# Altium schematic sheet NandFlash.SchDoc: main_assy PCB
size A4
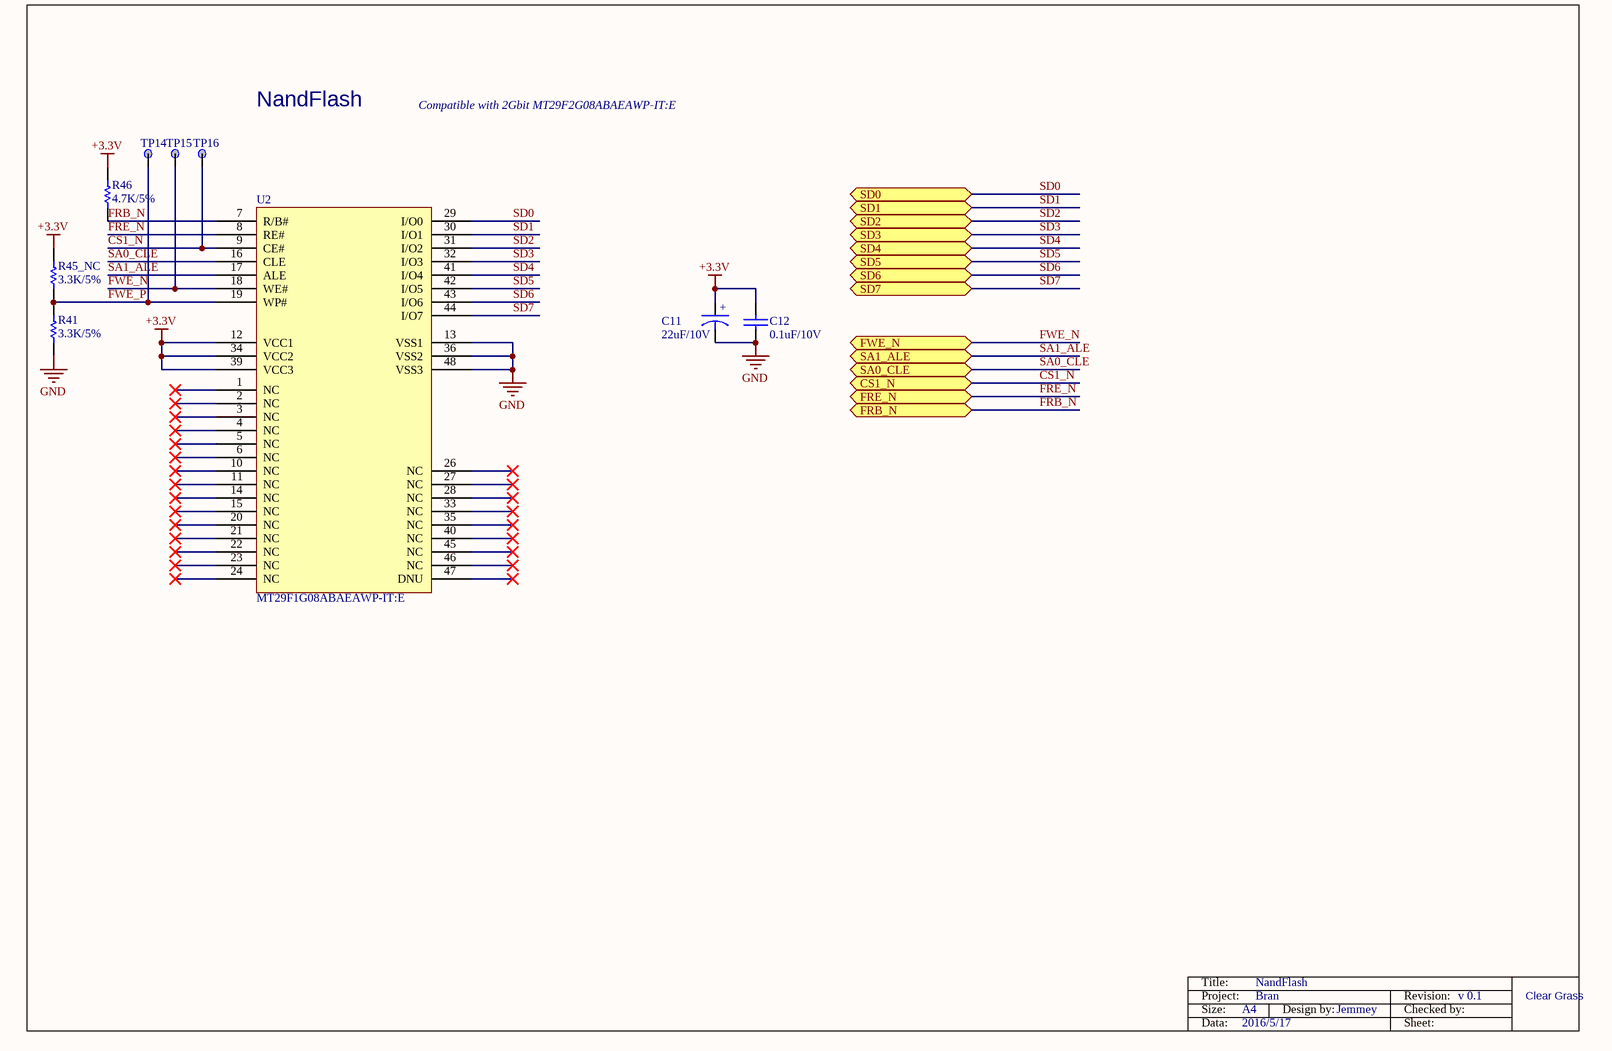
[diagram p0: NandFlash.SchDoc]

## Parts
C11  22uF/10V  [6032]
C12  0.1uF/10V  [0402C]
R41  3.3K/5%  [0603R]
R45_NC  3.3K/5%  [0603R]
R46  4.7K/5%  [0603R]
TP14  TP  [TP_C40]  (value not drawn)
TP15  TP  [TP_C40]  (value not drawn)
TP16  TP  [TP_C40]  (value not drawn)
U2  MT29F1G08ABAEAWP-IT:E

## Ports
CS1_N (bidir), FRB_N (bidir), FRE_N (bidir), FWE_N (bidir), SA0_CLE (bidir), SA1_ALE (bidir), SD0 (bidir), SD1 (bidir), SD2 (bidir), SD3 (bidir), SD4 (bidir), SD5 (bidir), SD6 (bidir), SD7 (bidir)

## Nets
+3.3V: C11.1 C12.2 R45_NC.1 R46.1 U2.12(VCC1) U2.34(VCC2) U2.39(VCC3)
GND: C11.2 C12.1 R41.2 U2.13(VSS1) U2.36(VSS2) U2.48(VSS3)
CS1_N: TP16.1 U2.9(CE#) ; port CS1_N
FRB_N: R46.2 U2.7(R/B#) ; port FRB_N
FRE_N: U2.8(RE#) ; port FRE_N
FWE_N: TP15.1 U2.18(WE#) ; port FWE_N
FWE_P: R41.1 R45_NC.2 TP14.1 U2.19(WP#)
SA0_CLE: U2.16(CLE) ; port SA0_CLE
SA1_ALE: U2.17(ALE) ; port SA1_ALE
SD0: U2.29(I/O0) ; port SD0
SD1: U2.30(I/O1) ; port SD1
SD2: U2.31(I/O2) ; port SD2
SD3: U2.32(I/O3) ; port SD3
SD4: U2.41(I/O4) ; port SD4
SD5: U2.42(I/O5) ; port SD5
SD6: U2.43(I/O6) ; port SD6
SD7: U2.44(I/O7) ; port SD7

Not connected (* = marked no-connect by the designer): U2 1(NC)* 2(NC)* 3(NC)* 4(NC)* 5(NC)* 6(NC)* 10(NC)* 11(NC)* 14(NC)* 15(NC)* 20(NC)* 21(NC)* 22(NC)* 23(NC)* 24(NC)* 26(NC)* 27(NC)* 28(NC)* 33(NC)* 35(NC)* 40(NC)* 45(NC)* 46(NC)* 47(DNU)*

## Notes on the sheet
- NandFlash
- Compatible with 2Gbit MT29F2G08ABAEAWP-IT:E
- Title:
- Project:
- Size:
- Data:
- A4
- 2016/5/17
- Bran
- Design by:
- Jemmey
- Revision:
- Sheet:
- Checked by:
- v 0.1
- Clear Grass
- (in symbol Capacitor) +

## Library data of the parts
C11 = Capacitor
C12 = CAP: 厂家：Murata，型号：GRM155R71A104KA01D
R41 R45_NC R46 = Res1: Resistor; Value: 1K; Ordered by: Subcon; Published: 8-Jun-2000; Revision: July-2002: Re-released for DXP Platform.; Publisher: Altium Limited
TP14-TP16 = TP: Ordered by: Subcon
U2 = NandFlash